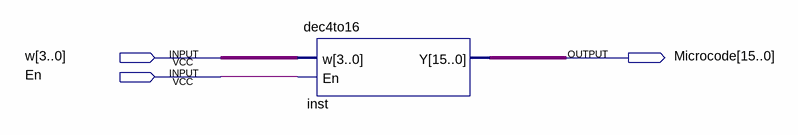
[diagram p0: schematic sheet]
// Quartus schematic individualBDF3.bdf as structural Verilog: 1 symbols, 3 pins
module individualBDF3 (
  input  [3:0] w,
  input  En,
  output [15:0] Microcode
);

  dec4to16 inst (.w(w), .En(En), .Y(Microcode));
endmodule
